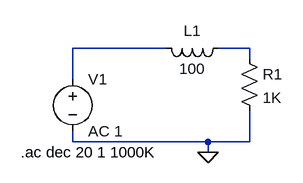
[diagram p0: schematic Inductive Design.asc]
Inductive Design.asc, the LTspice schematic file:
Version 4
SHEET 1 880 680
WIRE 96 96 -48 96
WIRE 224 96 176 96
WIRE 224 112 224 96
WIRE -48 144 -48 96
WIRE -48 240 -48 224
WIRE 160 240 -48 240
WIRE 224 240 224 192
WIRE 224 240 160 240
WIRE 160 256 160 240
FLAG 160 256 0
SYMBOL voltage -48 128 R0
SYMATTR InstName V1
SYMATTR Value AC 1
SYMBOL ind 192 80 R90
WINDOW 0 5 56 VBottom 2
WINDOW 3 32 56 VTop 2
SYMATTR InstName L1
SYMATTR Value 100
SYMBOL res 208 96 R0
SYMATTR InstName R1
SYMATTR Value 1K
TEXT -128 256 Left 2 !.ac dec 20 1 1000K

The netlist it stands for:
* Inductive Design.asc
V1 N001 0 AC 1
L1 N002 N001 100
R1 N002 0 1K
.ac dec 20 1 1000K
.backanno
.end